# Altium schematic sheet Arduino-Headers.SchDoc: TE0888 - Connectors
size A4; Organization: Trenz Electronic GmbH; DocumentNumber: TE0888; Revision: 01; SheetNumber: 2; SheetTotal: 5; Date: 20.05.2015; CompanyName: Trenz Electronic GmbH; ProjectName: TE0888
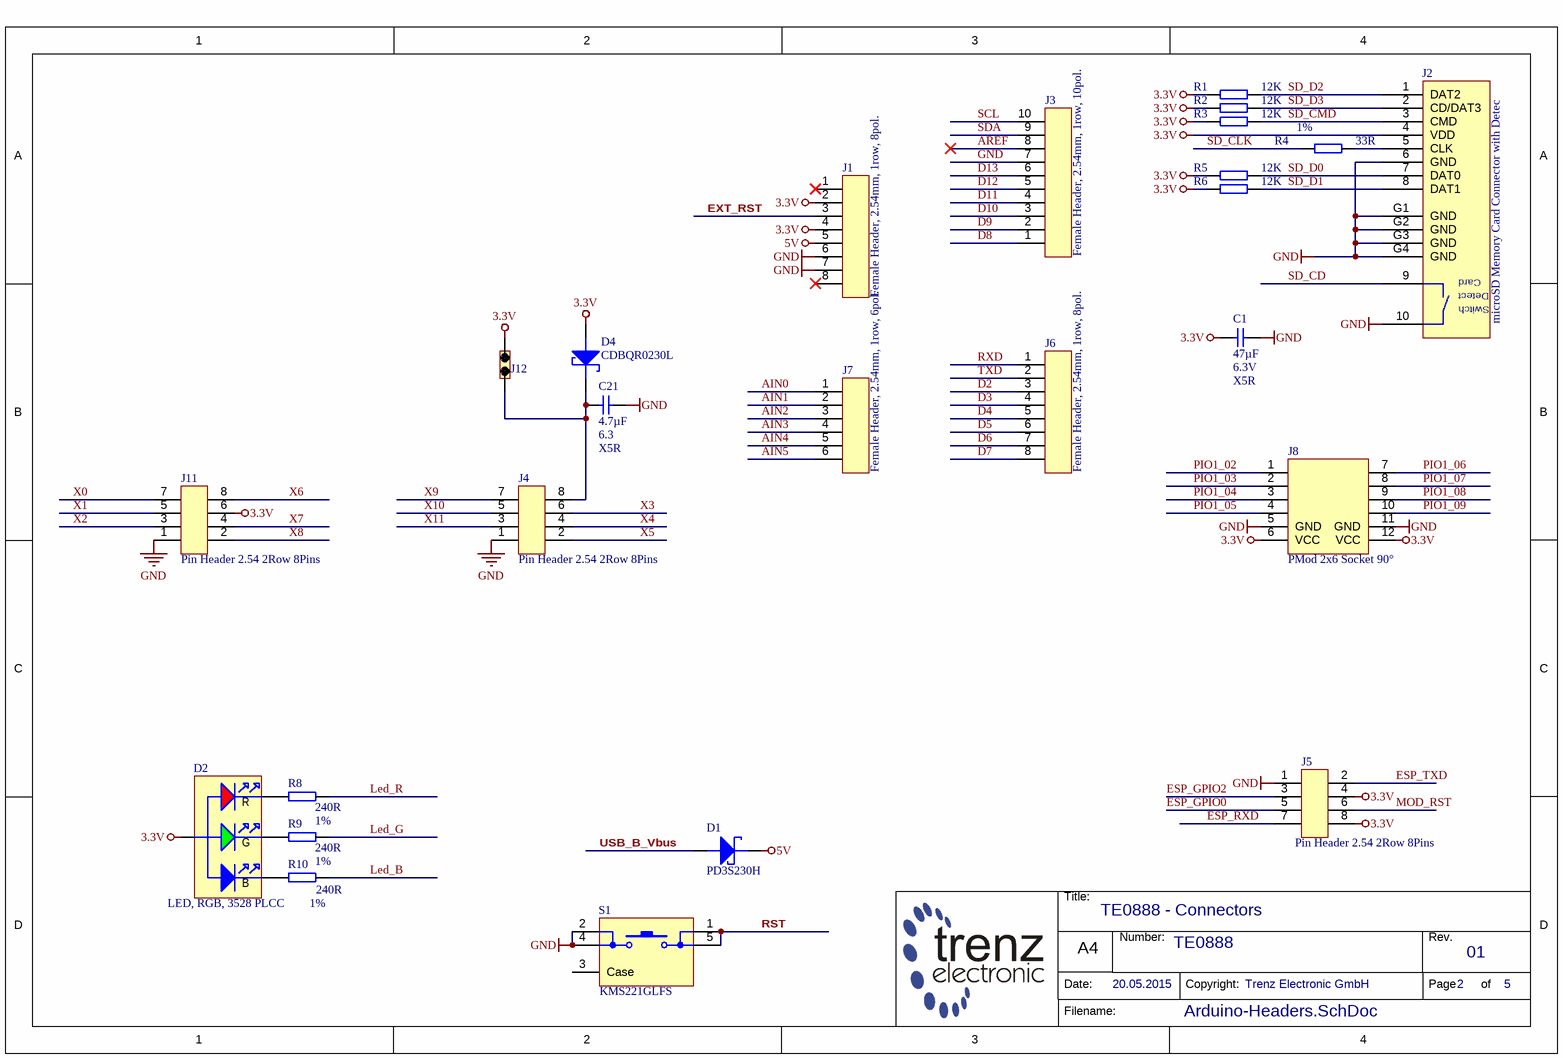
[diagram p0: Arduino-Headers.SchDoc]

## Parts
C1  47µF  Voltage: 6.3V  Technology: X5R  [CAPC2012X135N]
C21  4.7µF  Voltage: 6.3  Technology: X5R  [CAPC1005X60N]
D1  PD3S230H  [PowerDI323]
D2  LED, RGB, 3528 PLCC  [PLCC150P360X280X190-4N]
D4  CDBQR0230L  [DIOC1006X55N]
J1  Female Header, 2.54mm, 1row, 8pol.  [BUCHSENLEISTE-2.54-8-1R]
J2  microSD Memory Card Connector with Detec  [104031-0811]
J3  Female Header, 2.54mm, 1row, 10pol.  [BUCHSENLEISTE-2.54-10-1R]
J4  Pin Header 2.54 2Row 8Pins  [STIFTLEISTE2_54 OG 2R-8]
J5  Pin Header 2.54 2Row 8Pins  [STIFTLEISTE2_54 OG 2R-8]
J6  Female Header, 2.54mm, 1row, 8pol.  [BUCHSENLEISTE-2.54-8-1R]
J7  Female Header, 2.54mm, 1row, 6pol.  [BUCHSENLEISTE-2.54-6-1R]
J8  PMod 2x6 Socket 90°  [PMod2x6]
J11  Pin Header 2.54 2Row 8Pins  [STIFTLEISTE2_54 OG 2R-8]
J12  JUMPER2.54-2  [JUMPER2_54-2]  (value not drawn)
R1  12K  [RESC1005X40N]
R2  12K  [RESC1005X40N]
R3  12K  [RESC1005X40N]
R4  33R  Tolerance: 1%  [RESC0603X26N]
R5  12K  [RESC1005X40N]
R6  12K  [RESC1005X40N]
R8  240R  Tolerance: 1%  [RESC1005X40N]
R9  240R  Tolerance: 1%  [RESC1005X40N]
R10  240R  Tolerance: 1%  [RESC1005X40N]
S1  KMS221GLFS  [KMS2xxGLFS]

## Nets
3.3V: C1.1 D2.3(ANODE) D4.2(ANODE) J1.2 J1.4 J2.4(VDD) J5.4 J5.8 J8.6(VCC) J8.12(VCC) J11.6 J12.1 R1.1 R2.1 R3.1 R5.1 R6.1
5V: D1.1(KATHODE) J1.5
GND: C1.2 C21.1 J1.6 J1.7 J2.6(GND) J2.10(CDSW) J2.G1(GND) J2.G2(GND) J2.G3(GND) J2.G4(GND) J3.7 J4.1 J5.1 J8.5(GND) J8.11(GND) J11.1 S1.2 S1.4
AIN0: J7.1
AIN1: J7.2
AIN2: J7.3
AIN3: J7.4
AIN4: J7.5
AIN5: J7.6
AREF: J3.8
D2: J6.3
D3: J6.4
D4: J6.5
D5: J6.6
D6: J6.7
D7: J6.8
D8: J3.1
D9: J3.2
D10: J3.3
D11: J3.4
D12: J3.5
D13: J3.6
ESP_GPIO0: J5.5
ESP_GPIO2: J5.3
ESP_RXD: J5.7
ESP_TXD: J5.2
EXT_RST: J1.3
Led_B: R10.1
Led_G: R9.1
Led_R: R8.1
MOD_RST: J5.6
PIO1_02: J8.1
PIO1_03: J8.2
PIO1_04: J8.3
PIO1_05: J8.4
PIO1_06: J8.7
PIO1_07: J8.8
PIO1_08: J8.9
PIO1_09: J8.10
RST: S1.1 S1.5
RXD: J6.1
SCL: J3.10
SD_CD: J2.9(CDSW)
SD_CLK: R4.1
SD_CMD: J2.3(CMD) R3.2
SD_D0: J2.7(DAT0) R5.2
SD_D1: J2.8(DAT1) R6.2
SD_D2: J2.1(DAT2) R1.2
SD_D3: J2.2(CD/DAT3) R2.2
SDA: J3.9
TXD: J6.2
USB_B_Vbus: D1.2(ANODE)
X0: J11.7
X1: J11.5
X2: J11.3
X3: J4.6
X4: J4.4
X5: J4.2
X6: J11.8
X7: J11.4
X8: J11.2
X9: J4.7
X10: J4.5
X11: J4.3
NetC21_2: C21.2 D4.1(KATHODE) J4.8 J12.2
NetD2_1: D2.1(RED) R8.2
NetD2_2: D2.2(GREEN) R9.2
NetD2_4: D2.4(BLUE) R10.2
NetJ2_5: J2.5(CLK) R4.2

Not connected (* = marked no-connect by the designer): J1 1* 8*; S1 3(Case)

## Notes on the sheet
- Title:
- Number:
- Rev.
- Date:
- A4
- Copyright:
- Page
- of
- Filename:
- (in symbol 26299) R; G; B
- (in symbol 26322) Card; Detect; Switch

## Library data of the parts
C1 = 24718: KON 47µF 6,3V  X5R SMD 20%; AN: 24718; Mixed: SMT; Value: 47u; Preferred: Yes; Case: 2012 (0805); Tolerance: 20%
C21 = 24719: KON 4.7µF 6.3V X5R SMD 20%; AN: 24719; Mixed: SMT; Value: 4.7u; Preferred: Yes; Case: 1005 (0402); Tolerance: 20%
D1 = 24682: AN: 24682; Mixed: SMT; Case: PowerDI323; HelpURL: B:\AD\adlib\datasheet\PD3S230H
D2 = 26299: AN: 26299; Mixed: SMT; Case: 3528 PLCC; HelpURL: B:\AD\adlib\datasheet\Multicomp-LED-RGB-PLCC
D4 = 26726: AN: 26726; Mixed: SMT; Voltage: 0.2A; Value: 30V; Case: SOD-923F (0402); HelpURL: B:\ad\adlib\datasheet\CDBQR0230L
J1 J6 = 26387: Buchsenleiste 1 reihig präz. 8 pol.; AN: 26387; Mixed: THT
J2 = 26322: microSD Memory Card Connector with Detect Switch; AN: 26322; Mixed: SMT; Trenz-Stock: Yes; Case: microSD; HelpURL: B:\AD\adlib\datasheet\104031-0811
J3 = 26386: Buchsenleiste 1 reihig präz. 10 pol.; AN: 26386; Mixed: THT
J4 J5 J11 = 23904: Stiftleiste gerade 2-reihig, 8pol.; AN: 23904; Mixed: THT; Trenz-Stock: Yes
J7 = 26388: Buchsenleiste 1 reihig präz. 6 pol.; AN: 26388; Mixed: THT
J8 = 25215: AN: 25215; Trenz-Stock: Yes; Trenz-Article-Number: 23185; Mixed: THT
J12 = 22330: Stiftleiste gerade 1-reihig, 2pol.; AN: 22330; Mixed: THT; Trenz-Stock: Yes
R1-R3 R5 R6 = 22598: WID SMD 12K 1% 0,063W; AN: 22598; Mixed: SMT; Preferred: Yes; Case: 1005 (0402); Value: 12K
R4 = 25021: WID SMD 33R 1% 0,05W; AN: 25021; Mixed: SMT; Value: 33; Preferred: Yes; Case: 0603 (0201); HelpURL: B:\AD\adlib\datasheet\R0201
R8-R10 = 23661: WID SMD 240R 1% 0,063W; AN: 23661; Mixed: SMT; Value: 240; Preferred: Yes; Case: 1005 (0402)
S1 = 26229: KMS221GLFS - SWITCH, SPST, 0.05A, 32VDC, SMD; AN: 26229; Mixed: SMT; HelpURL: B:\AD\adlib\datasheet\KMS